# EAGLE schematic simpleSeriesLED (EAGLE 9.3.1)
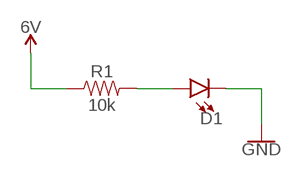
[diagram p0: schematic, sheet 1]

## Parts
D1  LED5MM  [LED_5MM]
R1  10k  10KOHM-HORIZ-1/4W-1%  [AXIAL-0.3]

## Nets
GND: D1.K(C)
N$1: D1.A R1.P$2
VCC: R1.P$1 ; supply symbol labelled 6V

## Library data of the parts
D1 = SparkFun-LED:LED: LED (Generic) Standard schematic elements and footprints for 5mm, 3mm, 1206, and 0603 sized LEDs. Generic LEDs with no color specified.
R1 = SparkFun-Resistors:10KOHM: 10kΩ resistor A resistor is a passive two-terminal electrical component that implements electrical resistance as a circuit element. Resistors act to reduce current flow, and, at the same time, act to lower voltage levels within circuits. - Wikipedia; PROD_ID: RES-12183